# Altium project USBtoUARTbreakout.PrjPcb
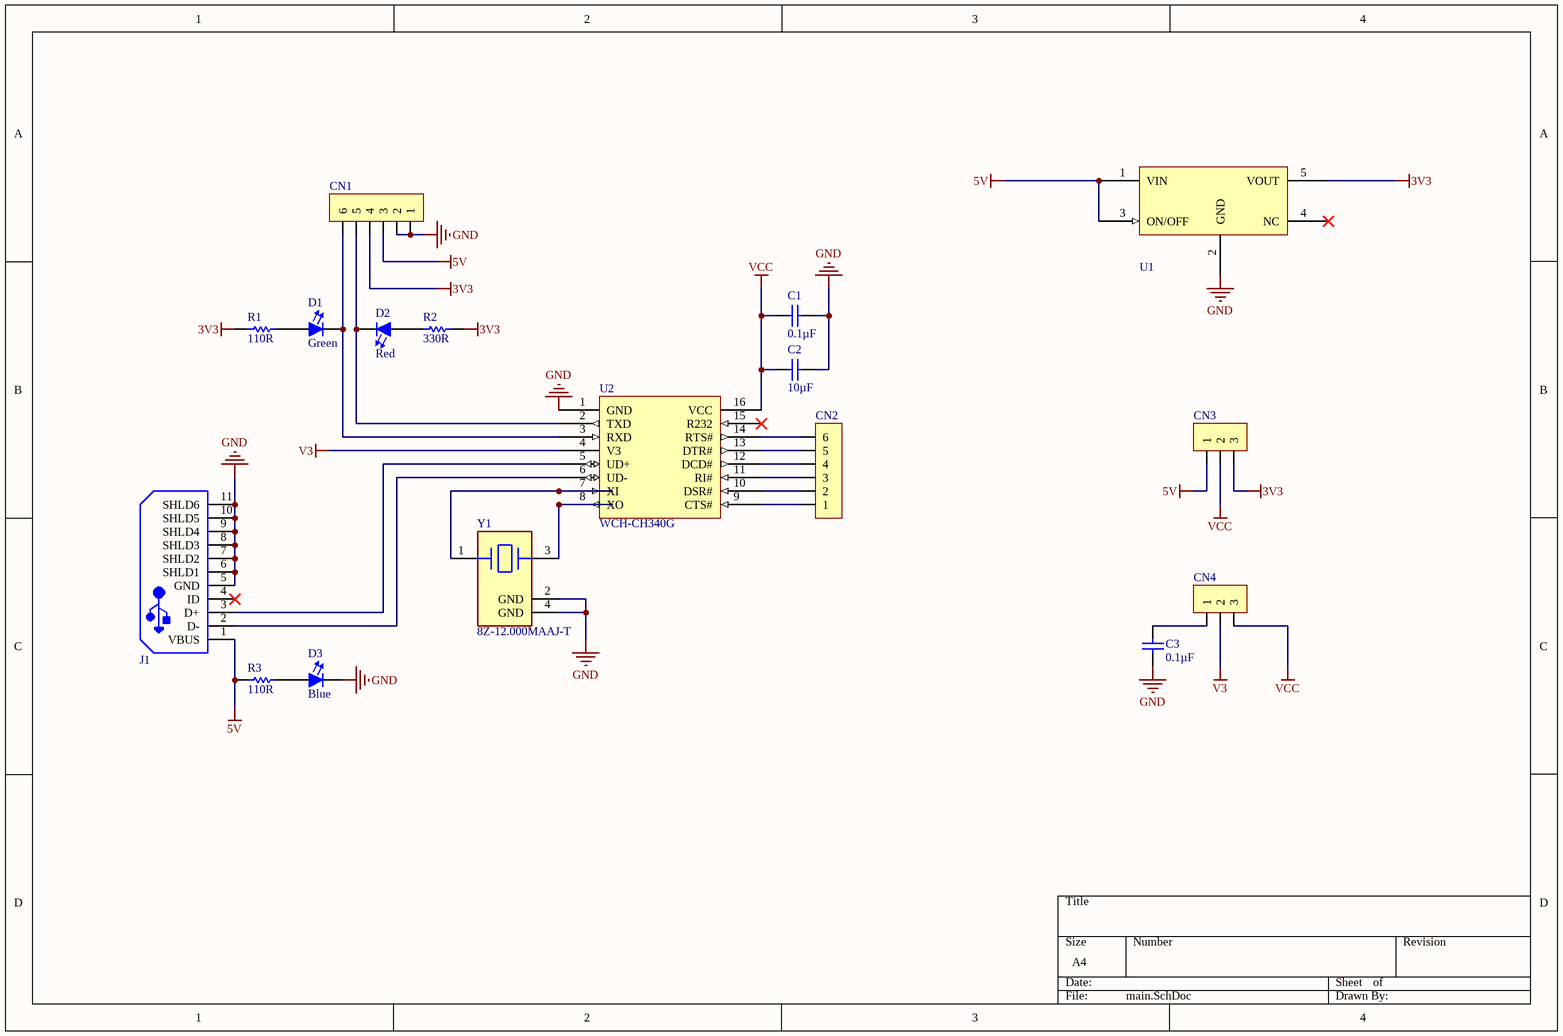
[diagram p0: main.SchDoc]
1 sheet, 17 parts. Net scope: global (net labels, ports and power ports of the same name join across sheets).
Board file: USBtoUARTboard.PcbDoc

## Sheet main.SchDoc
size A4

### Parts
C1  value 0.1µF  [CAPC1608N(0603")]  (hidden comment: 0.1uF 16V 0603 SMD, Ceramic)
C2  value 10µF  [CAPC1608N(0603")]  (hidden comment: 0.1uF 16V 0603 SMD, Ceramic)
C3  value 0.1µF  [CAPC1608N(0603")]  (hidden comment: 0.1uF 16V 0603 SMD, Ceramic)
CN1  Header, Male, 1x6  [Header, Male, 1X6]  (value not drawn)
CN2  Header, Male, 1x6  [Header, Male, 1X6]  (value not drawn)
CN3  Header, Male, 1x3, Pitch: 0.1" (2.54mm), THT  [Header, Male, 1x3, Pitch: 0.1" (2.54mm),THT]  (value not drawn)
CN4  Header, Male, 1x3, Pitch: 0.1" (2.54mm), THT  [Header, Male, 1x3, Pitch: 0.1" (2.54mm),THT]  (value not drawn)
D1  Color: Green  [FP-LB_Q39E-MFG]  (hidden comment: LT Q39G-Q1OO-25-1)
D2  Color: Red  [FP-LB_Q39E-MFG]  (hidden comment: LSQ976-NR-1)
D3  Color: Blue  [FP-LB_Q39E-MFG]  (hidden comment: LBQ39E-N1OO-35-1)
J1  10118192-0002LF  [FCI-10118192-0001LF-5_V]  (value not drawn)
R1  Resistance: 110R  [RESC1608X55X25ML10T15]  (hidden comment: RC0603FR-07110RL)
R2  Resistance: 330R  [RESC1608X55X30LL20T10]  (hidden comment: RK73B1JTTD331J)
R3  Resistance: 110R  [RESC1608X55X25ML10T15]  (hidden comment: RC0603FR-07110RL)
U1  LP2981-33DBVR  [SOT95P280X145-5N]  (value not drawn)
U2  WCH-CH340G  [SOP127P600X175-16N]
Y1  8Z-12.000MAAJ-T  [FP-8Z-MFG]

### Nets
3V3: CN1.4 CN3.3 R1.2 R2.2 U1.5(VOUT)
5V: CN1.3 CN3.1 J1.1(VBUS) R3.2 U1.1(VIN) U1.3(ON/OFF)
GND: C1.2(Cathode) C2.2(Cathode) C3.1(Anode) CN1.1 CN1.2 D3.1(Cathode) J1.5(GND) J1.6(SHLD1) J1.7(SHLD2) J1.8(SHLD3) J1.9(SHLD4) J1.10(SHLD5) J1.11(SHLD6) U1.2(GND) U2.1(GND) Y1.2(GND) Y1.4(GND)
V3: CN4.2 U2.4(V3)
VCC: C1.1(Anode) C2.1(Anode) CN3.2 CN4.3 U2.16(VCC)
NetC3_2: C3.2(Cathode) CN4.1
NetCN1_5: CN1.5 D2.1(Cathode) U2.2(TXD)
NetCN1_6: CN1.6 D1.1(Cathode) U2.3(RXD)
NetCN2_1: CN2.1 U2.9(CTS#)
NetCN2_2: CN2.2 U2.10(DSR#)
NetCN2_3: CN2.3 U2.11(RI#)
NetCN2_4: CN2.4 U2.12(DCD#)
NetCN2_5: CN2.5 U2.13(DTR#)
NetCN2_6: CN2.6 U2.14(RTS#)
NetD1_2: D1.2(Anode) R1.1
NetD2_2: D2.2(Anode) R2.1
NetD3_2: D3.2(Anode) R3.1
NetJ1_2: J1.2(D-) U2.6(UD-)
NetJ1_3: J1.3(D+) U2.5(UD+)
NetU2_7: U2.7(XI) Y1.1
NetU2_8: U2.8(XO) Y1.3

Not connected (* = marked no-connect by the designer): J1 4(ID)*; U1 4(NC)*; U2 15(R232)*

### Library data of the parts
C1-C3 = CMP-006-0005-1: Capacitor, Ceramic, 16V, +/- 10%, 0603 SMD, X7R; Created By: Andy Bates; Published: 16-04-26; PackageDescription: Chip Capacitor; Pin Count: 2; Source: AUVic_Schematic_Library_Capacitors.SchLib; Design Item ID: 0.1uF 16V 0603 SMD, Ceramic; Component Type: Standard; Publisher: AUVic
CN1 CN2 = CMP-005-0031-1: 1x6, Pads Pitch: 0.1" (2.54mm), Through hole; Made Bates: Andy Bates; Pin Count: 6; Component Type: Standard; Design Item ID: Header, Male, 1x6; Source: AUVic_Schematic_Library_Connectors.SchLib; Supplier 1 Part Number: 952-2270-ND
CN3 CN4 = CMP-005-0025-1: Created By: Ashwin Sira; Pin Count: 3; Component Type: Standard; Design Item ID: Header, Male, 1x3, Pitch: 0.1" (2.54mm), THT; Reviewed By: *; Last Updated: *; Source: AUVic_Schematic_Library_Connectors.SchLib; Publisher: AUVic; Date Published: 2016-03-03
D1 = CMP-00064-3: LED GREEN DIFFUSED 0603 SMD; Dominant Wavelength: 530nm; Luminous Intensity: 280mcd; Lens Style: Diffused,Colorless,Rectangular; Number of LEDs: 1; Forward Voltage: 2.85V; Test Current: 5mA; Reverse Voltage: 5V; Forward Current: 15mA; Luminous Flux: 0.55lm; Radiation Hardening: No; Packaging: Tape and Reel; Mount: Surface Mount; Max Operating Temperature: 85°C; Number of Elements: 1; Number of Pins: 2; Min Operating Temperature: -40°C; Depth: 0.9mm; Case/Package: SMD/SMT; Length: 1.7mm
D2 = CMP-00066-2: LED Red 645nm 2-Pin Chip 0603(1608Metric) T/R; Lens Transparency: Diffused; Power Dissipation: 65mW; Forward Voltage: 2.5V; Dominant Wavelength: 633nm; Number of Elements: 1; Lens Style: Diffused,Flat,Colorless,Rectangular; Lens Color: White; Viewing Angle: 160°; Luminous Flux: 0.33lm; Test Current: 20mA; Forward Current: 25mA; Luminous Intensity: 180mcd; Reverse Voltage: 12V; Lens Size: 0.8mm; Max Operating Temperature: 85°C; Depth: 0.9mm; Illumination Color: Red; Packaging: Tape and Reel; Min Operating Temperature: -30°C; Case Code (Imperial): 0603; Case Code (Metric): 1608; Number of Pins: 2; Mount: Surface Mount; Height: 0.8mm; Package Quantity: 1; Length: 1.7mm; Width: 0.8mm; Number of LEDs: 1; Case/Package: 0603; Radiation Hardening: No
D3 = CMP-00063-3: LED BLUE DIFFUSED 0603 SMD; Luminous Flux: 0.13lm; Lens Size: 0.8mm; Lens Color: White; Viewing Angle: 130°; Luminous Intensity: 42mcd; Number of LEDs: 1; Dominant Wavelength: 470nm; Lens Style: Flat,Diffused,Colorless,Rectangular; Test Current: 5mA; Forward Voltage: 2.85V; Packaging: Tape and Reel; Case/Package: 0603; Height: 0.4mm; Number of Pins: 2; Mount: Surface Mount; Case Code (Metric): 1608; Case Code (Imperial): 0603; Lens Transparency: Diffused; Width: 0.8mm; Length: 1.6mm; Radiation Hardening: No
J1 = CMP-002-00001-1: CONN RCPT USB2.0 MICRO B SMD R/A; DK Part Number: 609-5379-1-ND; Gender: Receptacle; Number of Terminals/Pins: 5; Current Rating: 1.8A; Pitch: 0.65mm; Insulation Resistance: 1GR; Voltage Rating: 100V; Connector Type: USB,Receptacle; Number of Ports: 1; Max Operating Temperature: 85°C; Features: Shielded; Depth: 5.57mm; Contact Plating: Gold; Termination: Solder; Number of Contacts: 5; Radiation Hardening: No; Flammability Rating: UL94 V-0; Lead Free: Lead Free; REACH SVHC: No SVHC; Orientation: Right Angle; USB Standard: USB 2.0; Mount: Surface Mount,Horizontal; Color: Black; Package Quantity: 1400; Length: 7.86mm; Packaging: Tape and Reel; Housing Material: Polymer; Contact Material: Copper Alloy; Min Operating Temperature: -55°C; Max Voltage Rating (AC): 100V
R1 R3 = CMP-00069-1: RES SMD 110 OHM 1% 1/10W 0603; Max Power Dissipation: 100mW; Voltage Rating (DC): 50V; Temperature Coefficient: 100ppm/°C; Working Voltage: 75V; Military Standard: Not; Termination: SMD/SMT; Number of Terminations: 2; Features: Moisture Resistant; Min Operating Temperature: -55°C; Power Rating: 100mW; Height: 0.022inch; Package Quantity: 1; Lead Free: Lead Free; Tolerance: 1%; Voltage Rating: 50V; Composition: Thick Film; Case Code (Imperial): 0603; Length: 1.6mm; Packaging: Tape and Reel; Case Code (Metric): 1608; Max Operating Temperature: 155°C; Depth: 0.8mm; Case/Package: 0603; Width: 0.031inch
R2 = CMP-00107-1: Res Thick Film 0603 330 Ohm 5% 0.1W(1/10W) ±200ppm/C Molded SMD Automotive T/R; Voltage Rating (DC): 50V; Temperature Coefficient: 200ppm/°C; Power Rating: 100mW; REACH SVHC: Unknown; Packaging: Tape and Reel; Case/Package: 0603; Height: 0.45mm; Length: 1.6mm; Termination: SMD/SMT; Depth: 0.8mm; Tolerance: 5%; Voltage Rating: 50V; Min Operating Temperature: -55°C; Lead Free: Lead Free; Resistor Type: Thick Film; Military Standard: Not; Case Code (Metric): 1608; Max Operating Temperature: 155°C; Mount: Surface Mount; Case Code (Imperial): 0603; Digikey: 2019-RK73B1JTTD331JCT-ND
U1 = CMP-044-0003-2: IC REG LINEAR 3.3V 100MA SOT23-5; Max Input Voltage: 16V; Min Input Voltage: 2.2V; Number of Regulators: 1; Output Voltage Accuracy: 2%; Polarity: Positive; Input Bias Current: 600uA; Output Type: Fixed; Dropout Voltage: 200mV; Package Quantity: 1; REACH SVHC: No SVHC; Output Voltage: 3.3V; Min Operating Temperature: -40°C; Case/Package: SOT-23; Max Output Current: 100mA; Lead Free: Lead Free; Max Operating Temperature: 125°C; Number of Outputs: 1; Number of Pins: 5; Mount: Surface Mount; Accuracy: 2%; Nominal Output Voltage: 3.3V; Output Current: 100mA; Packaging: Tape and Reel; Quiescent Current: 600uA; Radiation Hardening: No; Contact Plating: Tin,Matte
U2 = CMP-031-0001-1: USB to UART Transceiver. USB 2.0 2Mbps. LCSC #C14267; LCSC Part Number: C14267
Y1 = CMP-18717-000009-1: CRYSTAL 12.0000MHZ 18PF SMD; ESR (Equivalent Series Resistance): 150R; Frequency Tolerance: 30ppm; Frequency: 12MHz; Number of Pins: 4; Width: 0.079inch; Termination: SMD/SMT; Packaging: Tape and Reel; Height: 0.022inch; Load Capacitance: 18pF; Max Operating Temperature: 70°C; REACH SVHC: No SVHC; Tolerance: 30ppm; Length: 2.5mm; Depth: 2mm; Package Quantity: 1; Case/Package: SMD/SMT; Mount: Surface Mount; Frequency Stability: 30ppm; Min Operating Temperature: -20°C